# Altium schematic sheet HallEffect.SchDoc
size A4
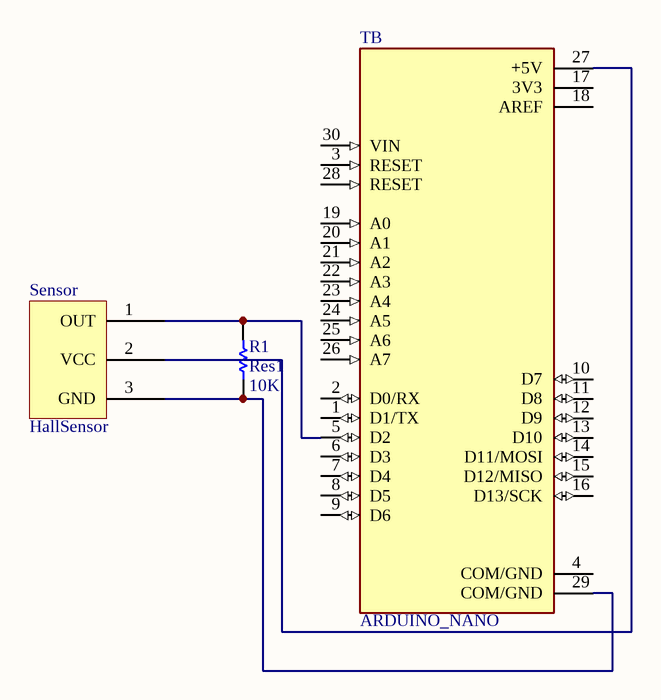
[diagram p0: HallEffect.SchDoc]

## Parts
R1  Res1  value 10K  [AXIAL-0.3]
Sensor  HallSensor  [HallSensor]
TB  ARDUINO_NANO  [SHIELD_ARDUINO_NANO]

## Nets
NetR1_1: R1.1 Sensor.3(GND) TB.29(COM/GND)
NetR1_2: R1.2 Sensor.1(OUT) TB.5(D2)
NetSensor_2: Sensor.2(VCC) TB.27(+5V)

Not connected (* = marked no-connect by the designer): TB 1(D1/TX) 2(D0/RX) 3(RESET) 4(COM/GND) 6(D3) 7(D4) 8(D5) 9(D6) 10(D7) 11(D8) 12(D9) 13(D10) 14(D11/MOSI) 15(D12/MISO) 16(D13/SCK) 17(3V3) 18(AREF) 19(A0) 20(A1) 21(A2) 22(A3) 23(A4) 24(A5) 25(A6) 26(A7) 28(RESET) 30(VIN)

## Library data of the parts
R1 = Res1: Resistor; Published: 8-Jun-2000; LatestRevisionDate: 17-Jul-2002; LatestRevisionNote: Re-released for DXP Platform.; PackageReference: AXIAL-0.3; Publisher: Altium Limited; PackageDescription: Axial Device, Thru-Hole; 2 Leads; 0.3 in Pin Spacing
TB = ARDUINO_NANO: ATSAMD21G18A Arduino Nano 33 IoT SAM D ARMÂ® CortexÂ®-M0+ MCU 32-Bit Embedded Evaluation Board; MP: ARDUINO NANO; Package: None; Price: None; Availability: Unavailable; Value: *; MF: Arduino; SnapEDA_Link: https://www.snapeda.com/parts/ARDUINO%20NANO/Arduino/view-part/1128261/?ref=snap